# Altium schematic sheet mux.SchDoc
size A
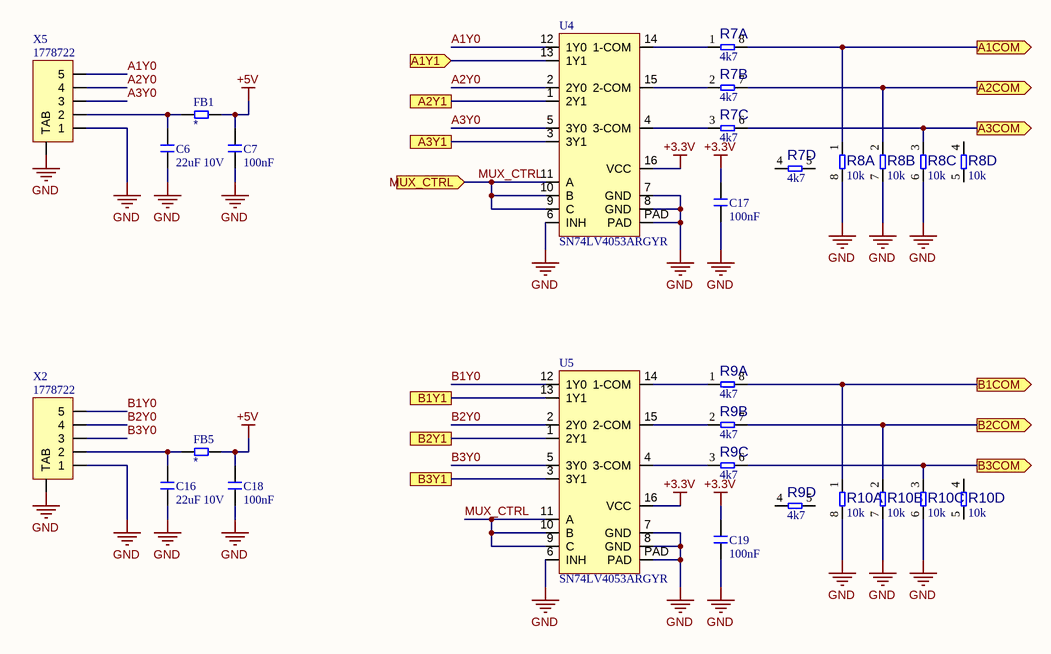
[diagram p0: mux.SchDoc]

## Parts
C6  22uF 10V  [C1210_N]
C7  100nF  [C0603_N]
C16  22uF 10V  [C1210_N]
C17  100nF  [C0603_N]
C18  100nF  [C0603_N]
C19  100nF  [C0603_N]
FB1  Ferrite  [R0603]  (value not drawn)
FB5  Ferrite  [R0603]  (value not drawn)
R7  4k7  [YC164]  (parts A,B,C,D of 4)
R8  10k  [YC164]  (parts A,B,C,D of 4)
R9  4k7  [YC164]  (parts A,B,C,D of 4)
R10  10k  [YC164]  (parts A,B,C,D of 4)
U4  SN74LV4053ARGYR  [QFN16]
U5  SN74LV4053ARGYR  [QFN16]
X2  1778722  [PTSM-5W-V-SMD]
X5  1778722  [PTSM-5W-V-SMD]

## Ports
A1COM (out), A1Y1 (in), A2COM (out), A2Y1, A3COM (out), A3Y1, B1COM (out), B1Y1, B2COM (out), B2Y1, B3COM (out), B3Y1, MUX_CTRL (in)

## Nets
+3.3V: C17.1 C19.1 U4.16(VCC) U5.16(VCC)
+5V: C7.1 C18.1 FB1.2 FB5.2
GND: C6.2 C7.2 C16.2 C17.2 C18.2 C19.2 R8.6 R8.7 R8.8 R10.6 R10.7 R10.8 U4.6(INH) U4.7(GND) U4.8(GND) U4.PAD U5.6(INH) U5.7(GND) U5.8(GND) U5.PAD X2.1 X2.TAB X5.1 X5.TAB
A1COM: R7.8 R8.1 ; port A1COM
A1Y0: U4.12(1Y0) X5.5
A1Y1: U4.13(1Y1) ; port A1Y1
A2COM: R7.7 R8.2 ; port A2COM
A2Y0: U4.2(2Y0) X5.4
A2Y1: U4.1(2Y1) ; port A2Y1
A3COM: R7.6 R8.3 ; port A3COM
A3Y0: U4.5(3Y0) X5.3
A3Y1: U4.3(3Y1) ; port A3Y1
B1COM: R9.8 R10.1 ; port B1COM
B1Y0: U5.12(1Y0) X2.5
B1Y1: U5.13(1Y1) ; port B1Y1
B2COM: R9.7 R10.2 ; port B2COM
B2Y0: U5.2(2Y0) X2.4
B2Y1: U5.1(2Y1) ; port B2Y1
B3COM: R9.6 R10.3 ; port B3COM
B3Y0: U5.5(3Y0) X2.3
B3Y1: U5.3(3Y1) ; port B3Y1
MUX_CTRL: U4.9(C) U4.10(B) U4.11(A) U5.9(C) U5.10(B) U5.11(A) ; port MUX_CTRL
NetC6_1: C6.1 FB1.1 X5.2
NetC16_1: C16.1 FB5.1 X2.2
NetR7_1: R7.1 U4.14(1-COM)
NetR7_2: R7.2 U4.15(2-COM)
NetR7_3: R7.3 U4.4(3-COM)
NetR9_1: R9.1 U5.14(1-COM)
NetR9_2: R9.2 U5.15(2-COM)
NetR9_3: R9.3 U5.4(3-COM)

Not connected (* = marked no-connect by the designer): R7 4 5; R8 4 5; R9 4 5; R10 4 5

## Library data of the parts
C6 C7 C16-C19 = Capacitor: Capacitor MLCC; Manufacturer: Yageo; Manufacturer Part Number: CC0603KRX7R9BB104; Tolerance (%): 10; Category: Capacitor; Package: 0603; Supplier Part Number 1: 1362556; Supplier 1: Farnell; ComponentLink1URL: http://www.yageo.com; ComponentLink1Description: Manufacturer Website; Voltage Rating (Volts): *; Supplier 2: Digi-Key; Supplier Part Number 2: 311-1344-1-ND
  C6 C16: Value: 22uF 10V
  C7 C17-C19: Value: 100nF
FB1 FB5 = Resistor: Published: 17-Dec-2003; LatestRevisionDate: 19-Mar-2004; LatestRevisionNote: Silkscreen size reduced.; PackageDocument: Mar-2003; PackageReference: 3-0603; Publisher: Altium Limited; Code_IPC: 1608 [0603]; ComponentLink1Description: Manufacturer Link; ComponentLink1URL: http://www.panasonic.com/industrial/components/resistive_products.htm; ComponentLink2Description: Datasheet; ComponentLink2URL: http://www.panasonic.com/industrial/components/pdf/AOA0000CE2.pdf; Value: *
R7-R10 = Resistor Array - 4P
  R7 R9: Value: 4k7
  R8 R10: Value: 10k
X2 X5 = Connector 5W - TAB